# EAGLE design backlight_board (EAGLE 6.4)
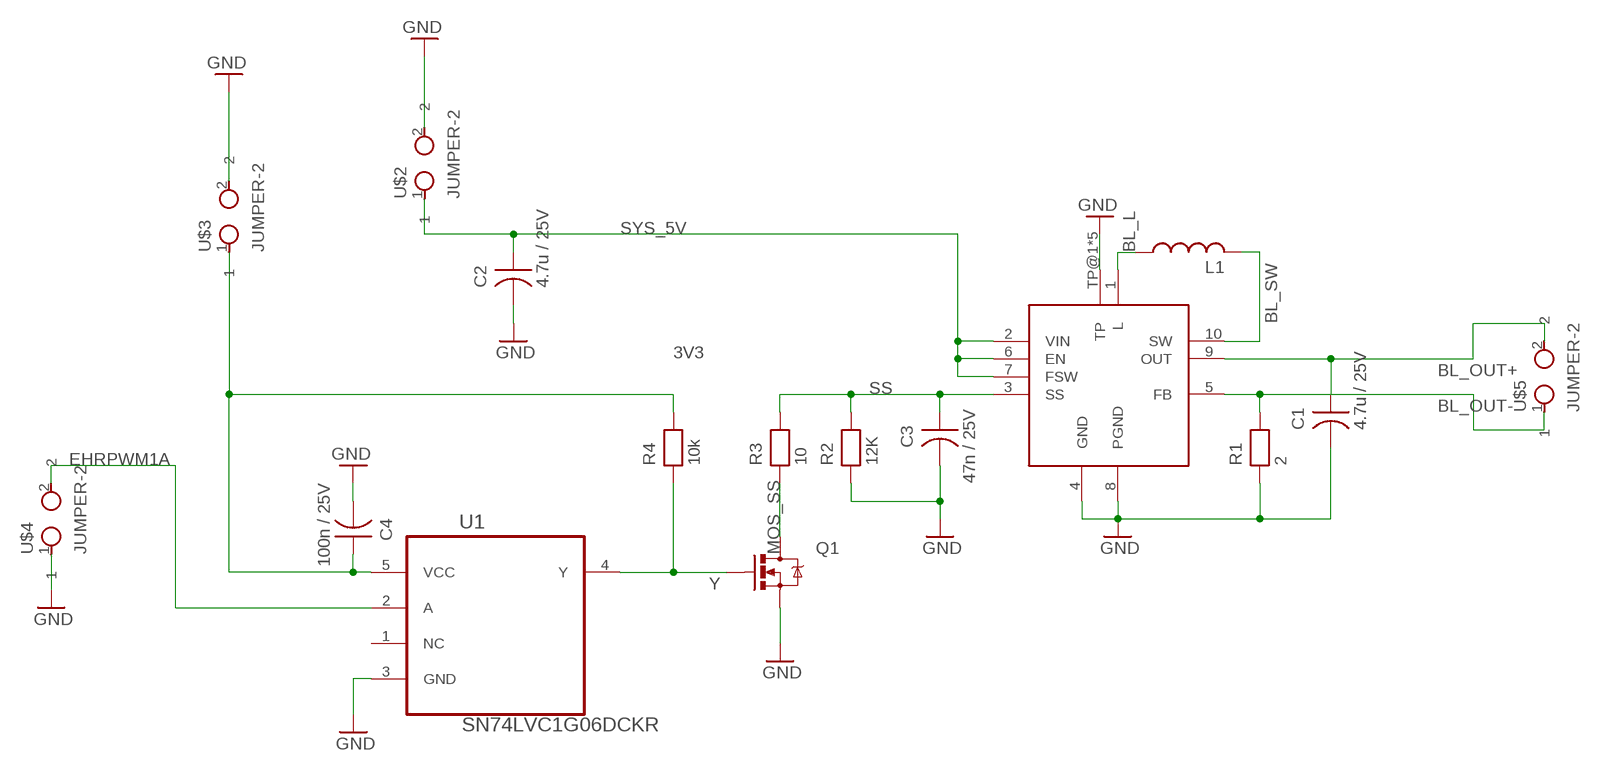
[diagram p0: schematic, sheet 1]

## Parts
C1  4.7u / 25V  PCAP0805LEVEL3  [R0805]
C2  4.7u / 25V  PCAP0805LEVEL3  [R0805]
C3  47n / 25V  PCAP0603LEVEL3  [R0603]
C4  100n / 25V  PCAP0603LEVEL3  [R0603]
L1  L-US  [VLCF4018-2]
Q1  MOSFET-NCHANNELBSS138  [SOT23]
R1  2  PRES0603LEVEL3  [R0603]
R2  12K  PRES0603LEVEL3  [R0603]
R3  10  PRES0603LEVEL3  [R0603]
R4  10k  PRES0603LEVEL3  [R0603]
U1  SN74LVC1G06DCKR  [SOT65P210X110-5N]
U$1  TPS61080  [VSON-10]
U$2  JUMPER-2  [1X02]
U$3  JUMPER-2  [1X02]
U$4  JUMPER-2  [1X02]
U$5  JUMPER-2  [1X02]

## Nets
3V3: C4.P$2 R4.P$2 U1.5(VCC) U$3.1
BL_L: L1.1 U$1.1(L)
BL_OUT+: C1.P$2 U$1.9(OUT) U$5.2
BL_OUT-: R1.P$2 U$1.5(FB) U$5.1
BL_SW: L1.2 U$1.10(SW)
EHRPWM1A: U1.2(A) U$4.2
GND: C1.P$1 C2.P$1 C3.P$1 C4.P$1 Q1.2(S) R1.P$1 R2.P$1 U1.3(GND) U$1.4(GND) U$1.8(PGND) U$1.TP@1(TP) U$1.TP@2(TP) U$1.TP@3(TP) U$1.TP@4(TP) U$1.TP@5(TP) U$2.2 U$3.2 U$4.1
MOS_SS: Q1.3(D) R3.P$1
SS: C3.P$2 R2.P$2 R3.P$2 U$1.3(SS)
SYS_5V: C2.P$2 U$1.2(VIN) U$1.6(EN) U$1.7(FSW) U$2.1
Y: Q1.1(G) R4.P$1 U1.4(Y)
Unconnected: U1.1(NC)

## Library data of the parts
C1 C2 = rcl_pro:PCAP0805
C3 C4 = rcl_pro:PCAP0603
L1 = rcl:L-US: INDUCTOR, American symbol
Q1 = SparkFun-DiscreteSemi:MOSFET-NCHANNEL: Common NMOSFET Parts MFG P/N Store ID Prod ID FDD8780 TRANS-09984 SI7820DN TRANS-11055 FDS6630A IC-08089 2N7002PW TRANS-11151 FQP30N06L COM-10213 TRANS-10060 BSS123LT1G TRANS-08345 BSS138 TRANS-00830 BS170 2N7000; PROD_ID: TRANS-00830
R1-R4 = rcl_pro:PRES0603
U1 = Texas Instruments_By_element14_Batch_1:SN74LVC1G06DCKR: SINGLE INVERTER BUFFER/DRIVER WITH OPEN-DRAIN OUTPUT; MPN: SN74LVC1G06DCKR; OC_FARNELL: 1871697; OC_NEWARK: 76C4074; PACKAGE: SC70-5; SUPPLIER: Texas Instruments
U$1 = ti_backlight_driver:TPS61080: LED Controller - INPUT: 2.5V - 6V - OUTPUT: Up to 27V - TYPICAL OUTPUT - INPUT: 5V - 12V @ 400mA - 24V @ 170mA - Short Circuit Protection - 1.2-MHz / 600-kHz Selectable Fixed Switching Frequency - In/Out Isolation - Boost Conversion - 3V - 12V - 5V - 12V - 24V
U$2-U$5 = pinhead:JUMPER-2

## Board
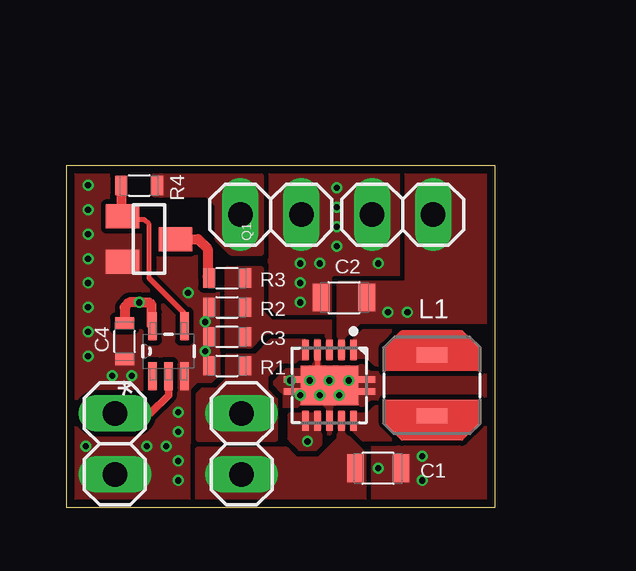
[diagram p1: board, top side]
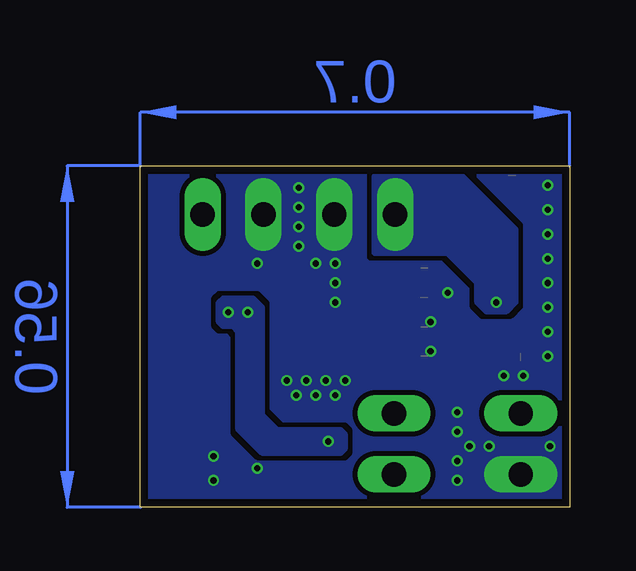
[diagram p2: board, bottom side, seen from below]

Size 17.88 x 14.22 mm. Coordinates in mm from the lower left corner, seen from the top.
Outline: 0,14.22 0,0 17.88,0 17.88,14.22 0,14.22
Copper layers (1*16): Top 0.035mm / dielectric 1.5mm / Bottom 0.035mm
Design rules "eagle_2_layer": minimum track width 8mil, minimum drill 10mil, track to track 8mil, track to pad 8mil, pad to pad 8mil, via to via 8mil, smd to smd 8mil, copper to edge 13mil, drill to drill 8mil, minimum pad ring 4mil, minimum via ring 4mil, stop-mask expansion 4mil, vias tented up to drill 14mil, thermal gap 10mil

### Footprints (pad centres in the part's own frame; a part is rotated, then mirrored left to right if it is on the bottom)
R0805 = smd 0.7 x 1.15: P$1 -0.95,0; P$2 0.95,0
R0603 = smd 0.5 x 0.8: P$1 -0.75,0; P$2 0.75,0
VLCF4018-2 = smd 1.27 x 0.635: 1 0,1.27; 2 0,-1.27
SOT23 = smd 1 x 1.4: 1 -0.95,-1.1; 2 0.95,-1.1; 3 0,1.1
SOT65P210X110-5N = smd 1.168 x 0.356: 1 -1.041,0.66; 2 -1.041,0; 3 -1.041,-0.66; 4 1.041,-0.66; 5 1.041,0.66
VSON-10 = smd 0.28 x 0.85: 1 -1,-1.475; 2 -0.5,-1.475; 3 0,-1.475; 4 0.5,-1.475; 5 1,-1.475; 6 1,1.475; 7 0.5,1.475; 8 0,1.475; 9 -0.5,1.475; 10 -1,1.475 | smd 2.4 x 1.65: TP@1 0,0 | smd 0.7 x 0.28: TP@2 -1.55,0.25; TP@3 -1.55,-0.25; TP@4 1.55,-0.25; TP@5 1.55,0.25
1X02 = drill 1.016 long: 1 -1.27,0; 2 1.27,0

### Placement (x,y rotation side)
C1  13,1.63 180 top
C2  11.58,8.74 0 top
C3  6.71,7.11 0 top
C4  2.44,6.91 90 top
L1  15.24,5.08 0 top
Q1  3.45,11.18 270 top
R1  6.71,5.89 0 top
R2  6.71,8.33 0 top
R3  6.71,9.55 0 top
R4  3.05,13.41 0 top
U1  4.27,6.5 90 top
U$1  10.97,5.08 180 top
U$2  14.02,12.19 180 top
U$3  8.53,12.19 0 top
U$4  2.03,2.64 90 top
U$5  7.32,2.64 270 top

### Tracks (layer width: path | path; a pad name or v marks a point on that pad's centre or on a via)
3V3  (via drill 0.25)
  Top 0.203: 3.56,7.59 U1.5
  Top 0.406: 3.56,7.59 3.56,8.43 3.45,8.53 v3.05,8.53 2.64,8.53 2.44,8.33 C4.P$2
  pour Top (no thermals): 3.66,13.82 8.13,13.82 8.13,10.57 6.91,10.57 6.3,11.18 6.3,12.6 5.89,13 3.66,13
  pour Bottom (no thermals): 8.13,13.82 4.47,13.82 2.24,11.58 2.24,8.53 2.64,8.13 3.45,8.13 3.86,8.53 3.86,9.35 5.08,10.57 8.13,10.57
BL_L
  pour Top (no thermals): 11.99,6.3 12.6,6.3 13.21,5.69 17.48,5.69 17.48,7.32 12.4,7.32 11.99,6.91
BL_OUT+
  pour Top (no thermals): 11.58,4.06 11.58,3.05 12.4,2.24 12.4,0.2 5.49,0.2 5.49,2.44 9.14,2.44 9.35,2.24 9.55,2.03 10.57,2.03 11.38,2.84 11.38,4.06
BL_OUT-
  pour Top (no thermals): 9.96,6.91 8.53,6.91 7.92,6.3 6.71,6.3 6.71,5.28 6.3,4.88 5.69,4.88 5.49,4.67 5.49,2.84 8.74,2.84 8.74,4.47 8.33,4.88 8.33,5.49 8.94,6.1 9.96,6.1
BL_SW
  pour Top (no thermals): 11.99,3.86 12.6,3.86 13.21,4.47 17.48,4.47 17.48,2.84 12.4,2.84 11.99,3.25
EHRPWM1A
  Top 0.305: U$4.2 3.5,3.91 4.27,4.67 U1.2
GND  (via drill 0.25)
  Top 0.203: U$1.4 10.47,5.6 v10.16,5.28
  other vias: 11.28,10.87 13,10.16 10.57,10.16 9.75,10.16 9.75,9.35 11.28,11.68 11.28,12.5 11.28,13.31 9.75,8.53 9.35,5.28 10.97,5.28 11.79,5.28 10.57,4.67 11.38,4.67 9.75,4.67 0.81,2.54 3.35,2.54 4.17,2.54 4.67,3.96 4.67,3.15 4.67,1.93 4.67,1.12 5.08,8.94 5.79,7.72 5.79,6.5 2.74,5.49 1.93,5.49 0.91,7.32 0.91,8.33 0.91,9.35 0.91,10.36 0.91,11.38 0.91,12.4 0.91,13.41 0.91,6.3 14.83,2.13 14.83,1.12 13,1.63
  pour Bottom (rank 6, no thermals): 0.2,14.02 17.68,14.02 17.68,0.2 0.2,0.2
  pour Top (rank 6, no thermals): 0.2,14.02 17.68,14.02 17.68,0.2 0.2,0.2
MOS_SS
  Top 0.406: Q1.3 5.49,11.18 5.89,10.77 5.89,9.61 R3.P$1
SS
  pour Top (isolate 0.203, rank 2, no thermals): 10.87,6.1 10.87,7.32 8.33,7.32 7.72,6.71 6.71,6.71 6.71,9.96 8.13,9.96 8.13,8.13 8.53,7.72 11.07,7.72 11.07,6.1
SYS_5V  (via drill 0.25)
  other vias: 10.06,2.74 13.41,8.13 14.22,8.13
  pour Top (isolate 0.203, no thermals): 11.38,6.3 11.38,9.35 14.22,9.35 14.22,14.02 17.68,14.02 17.68,7.72 12.19,7.72 11.58,7.11 11.58,6.3
  pour Top (no thermals): 9.35,3.86 10.57,3.86 10.57,2.64 10.36,2.44 9.75,2.44 9.35,2.84
  pour Bottom (no thermals): 13.41,8.74 13.21,8.74 12.8,8.33 12.8,3.86 12.19,3.25 9.55,3.25 9.35,3.05 9.35,2.44 9.55,2.24 12.8,2.24 13.82,3.25 13.82,7.32 14.02,7.52 14.43,7.52 14.63,7.72 14.63,8.53 14.43,8.74
Y
  Top 0.203: 2.3,12.18 Q1.1 2.49,11.99 3.25,11.99 3.45,11.79 3.45,9.55 4.93,8.08 U1.4
  Top 0.406: R4.P$1 2.3,12.18
(copper drawn outside any net)
  shapes: Bottom area x2